# Altium schematic sheet Buck_schematics.SchDoc
size A; SheetNumber: 1; SheetTotal: 1
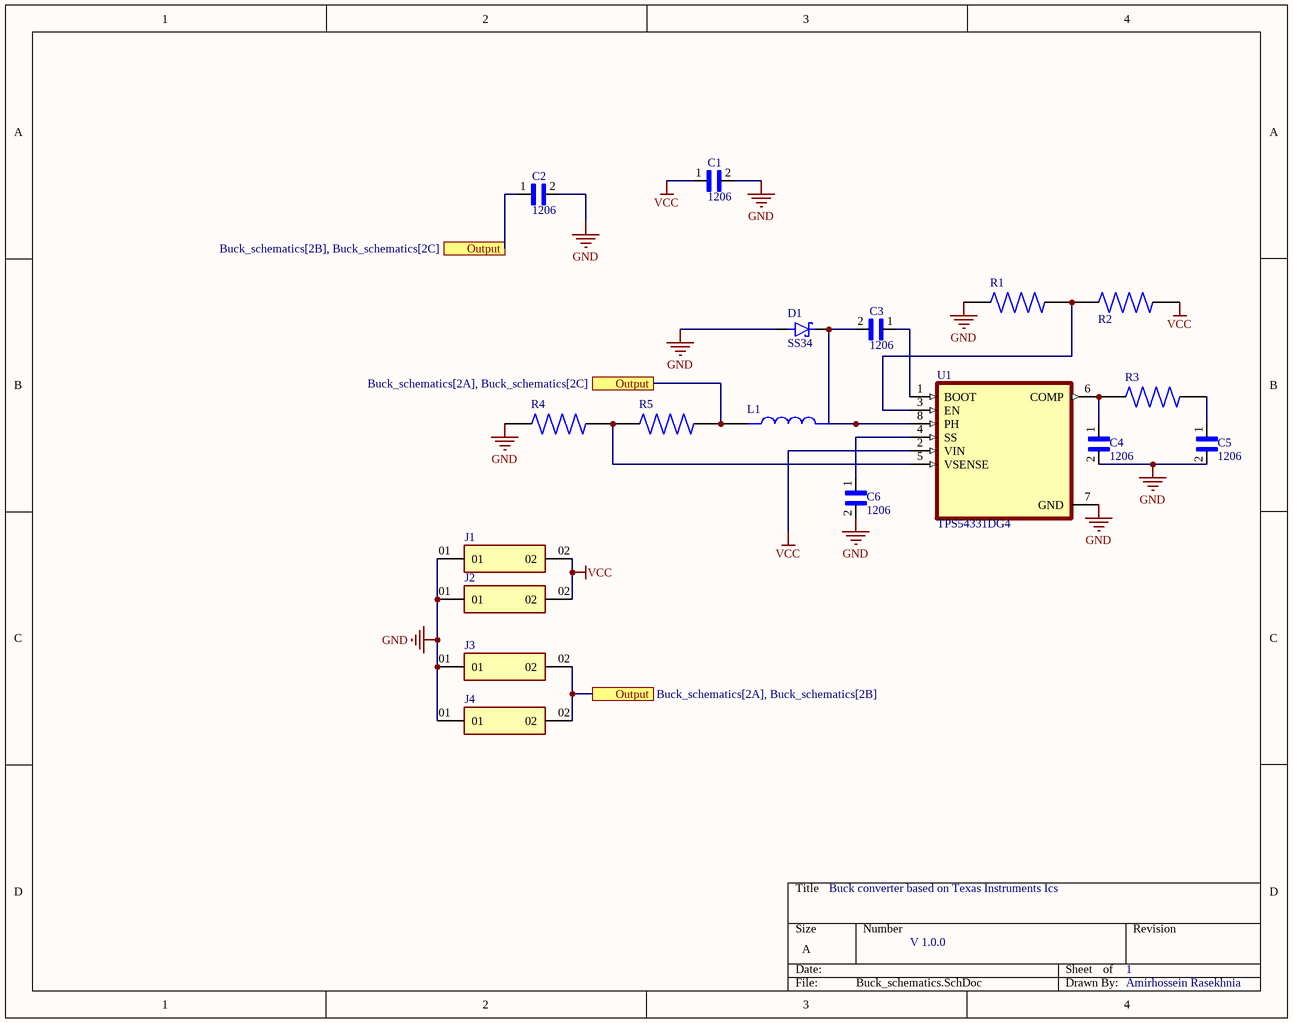
[diagram p0: Buck_schematics.SchDoc]

## Parts
C1  1206  [CAPC3216X170N]
C2  1206  [CAPC3216X170N]
C3  1206  [CAPC3216X170N]
C4  1206  [CAPC3216X170N]
C5  1206  [CAPC3216X170N]
C6  1206  [CAPC3216X170N]
D1  SS34  [DIO_SS34]
J1  TSW-101-23-S-D-LL  [SAMTEC_TSW-101-23-S-D-LL]  (value not drawn)
J2  TSW-101-23-S-D-LL  [SAMTEC_TSW-101-23-S-D-LL]  (value not drawn)
J3  TSW-101-23-S-D-LL  [SAMTEC_TSW-101-23-S-D-LL]  (value not drawn)
J4  TSW-101-23-S-D-LL  [SAMTEC_TSW-101-23-S-D-LL]  (value not drawn)
L1  1255AY-100M=P3  [IND_1255AY-100M=P3]  (value not drawn)
R1  ERJU08J274V  [RES_ERJU08J274V]  (value not drawn)
R2  ERJU08J274V  [RES_ERJU08J274V]  (value not drawn)
R3  ERJU08J274V  [RES_ERJU08J274V]  (value not drawn)
R4  ERJU08J274V  [RES_ERJU08J274V]  (value not drawn)
R5  ERJU08J274V  [RES_ERJU08J274V]  (value not drawn)
U1  TPS54331DG4  [SOIC127P599X175-8N]

## Ports
Output (see Buck_schematics[2A], Buck_schematics[2B]), Output (see Buck_schematics[2A], Buck_schematics[2C]), Output (see Buck_schematics[2B], Buck_schematics[2C])

## Nets
GND: C1.2 C2.2 C4.2 C5.2 C6.2 D1.A J1.01 J2.01 J3.01 J4.01 R1.1 R4.1 U1.7(GND)
VCC: C1.1 J1.02 J2.02 R2.1 U1.2(VIN)
Output: C2.1 J3.02 J4.02 L1.1 R5.2 ; port Output
NetC3_1: C3.1 U1.1(BOOT)
NetC3_2: C3.2 D1.C(K) L1.2 U1.8(PH)
NetC4_1: C4.1 R3.1 U1.6(COMP)
NetC5_1: C5.1 R3.2
NetC6_1: C6.1 U1.4(SS)
NetR1_2: R1.2 R2.2 U1.3(EN)
NetR4_2: R4.2 R5.1 U1.5(VSENSE)

## Notes on the sheet
- Buck converter based on Texas Instruments Ics
- V 1.0.0
- 1
- Amirhossein Rasekhnia

## Library data of the parts
C1-C6 = VJ1206A270KXCAP: Package: None; Price: None; Value: *; MP: VJ1206A270KXCAP; Availability: Unavailable
D1 = SS34: 3A, 40V, Schottky Rectifier; MF: Taiwan Semiconductor; SnapEDA_Link: https://www.snapeda.com/parts/SS34/Taiwan+Semiconductor/view-part/?ref=snap; Package: DO-214AB-2 Taiwan Semiconductor; Value: *; MP: SS34; Check_prices: https://www.snapeda.com/parts/SS34/Taiwan+Semiconductor/view-part/?ref=eda
L1 = 1255AY-100M=P3: Inductor with Inductance: 10uH Tol. +/-20%, Package: 2424 _6060_; MF: Murata; Digi-Key_Part_Number: 490-10800-1-ND; Value: *; SnapEDA_Link: https://www.snapeda.com/parts/1255AY-100M=P3/Murata/view-part/583912/?ref=snap; Digi-Key_Purchase_URL: https://www.digikey.com/product-detail/en/murata-electronics/1255AY-100M=P3/490-10800-1-ND/5271542?utm_source=snapeda&utm_medium=aggregator&utm_campaign=symbol; Package: NONSTANDARD; MP: 1255AY-100M=P3
R1-R5 = ERJU08J274V: 1206 anti-sulfurated resistor 1206 Anti-Sulfurated; MF: Panasonic; MP: ERJ-U08J274V; SnapEDA_Link: https://www.snapeda.com/parts/ERJ-U08J274V/Panasonic/view-part/?ref=snap; Package: 3216-2 Panasonic; Value: *; Check_prices: https://www.snapeda.com/parts/ERJ-U08J274V/Panasonic/view-part/?ref=eda
U1 = TPS54331DG4: 3.5V to 28V Input, 3A, 570kHz Step-Down Converter with Eco-mode 8-SOIC -40 to 150; MF: Texas Instruments; SnapEDA_Link: https://www.snapeda.com/parts/TPS54331DG4/Texas+Instruments/view-part/?ref=snap; Package: SOIC-8 Texas Instruments; Value: *; MP: TPS54331DG4; Check_prices: https://www.snapeda.com/parts/TPS54331DG4/Texas+Instruments/view-part/?ref=eda
J1-J4 = TSW-101-23-S-D-LL: Price: None; Value: *; Package: None; MP: TSW-101-23-S-D-LL; Availability: Unavailable